# Altium schematic sheet processor.SchDoc: JSK Ultra-tiny Laser Sensor Bottom PCB, JSK Lab, The University of Tokyo
size A4; DrawnBy: XIANGYU CHEN; Revision: V4.5; ProjectName: Jsk_laser Bottom PCB
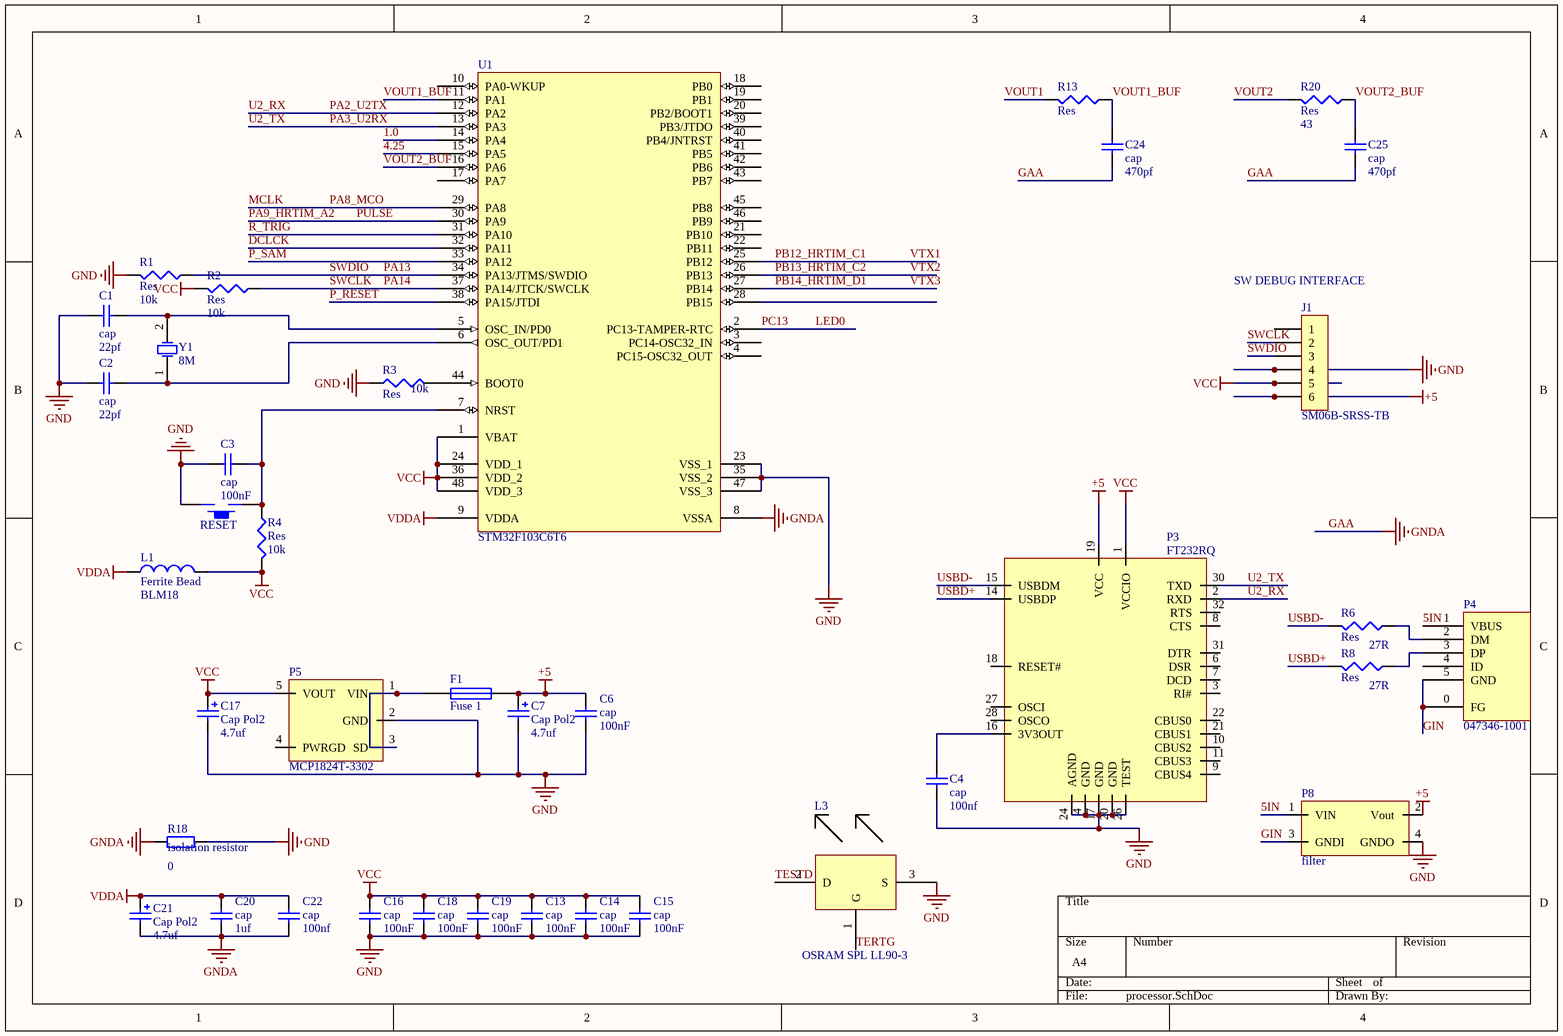
[diagram p0: processor.SchDoc]

## Parts
C1  cap  value 22pf  [J1-0603]
C2  cap  value 22pf  [J1-0603]
C3  cap  value 100nF  [J1-0603]
C4  cap  value 100nf  [J1-0603]
C6  cap  value 100nF  [J1-0603]
C7  Cap Pol2  value 4.7uf  [C1206+]
C13  cap  value 100nF  [J1-0603]
C14  cap  value 100nF  [J1-0603]
C15  cap  value 100nF  [J1-0603]
C16  cap  value 100nF  [J1-0603]
C17  Cap Pol2  value 4.7uf  [C1206+]
C18  cap  value 100nF  [J1-0603]
C19  cap  value 100nF  [J1-0603]
C20  cap  value 1uf  [J1-0603]
C21  Cap Pol2  value 4.7uf  [C1206+]
C22  cap  value 100nf  [J1-0603]
C24  cap  value 470pf  [J1-0603]
C25  cap  value 470pf  [J1-0603]
F1  Fuse 1  [J1-0603]
J1  SM06B-SRSS-TB  [SM06B-SRSS-TB]
L1  Ferrite Bead  value BLM18  [J1-0603]
L3  OSRAM SPL LL90-3  [SPLLL]
P3  FT232RQ  [QFN32]
P4  047346-1001  [047346-1001]
P5  MCP1824T-3302  [SOT-23]
P8  filter  [bx025]
R1  Res  value 10k  [J1-0603]
R2  Res  value 10k  [J1-0603]
R3  Res  value 10k  [J1-0603]
R4  Res  value 10k  [J1-0603]
R6  Res  value 27R  [J1-0603]
R8  Res  value 27R  [J1-0603]
R13  Res  [J1-0603]
R18  isolation resistor  value 0  [J1-0603]
R20  Res  value 43  [J1-0603]
RESET  KEY_M  [TSWITCH]  (value not drawn)
U1  STM32F103C6T6  [LQFP48_L]
Y1  8M  [XTALSMD8]

## Nets
+5: C6.2 C7.1 F1.2 J1.6 P3.19(VCC) P8.2(Vout)
GAA: C20.1 C21.2 C22.1 C24.1 C25.1 R18.1 U1.8(VSSA)  [also labelled GNDA]
GND: C1.1 C2.1 C3.1 C4.1 C6.1 C7.2 C13.1 C14.1 C15.1 C16.1 C17.2 C18.1 C19.1 J1.4 L3.3(S) P3.4(GND) P3.17(GND) P3.20(GND) P3.24(AGND) P3.26(TEST) P5.2(GND) P8.4(GNDO) R1.2 R3.1 R18.2 RESET.2 U1.23(VSS_1) U1.35(VSS_2) U1.47(VSS_3)
VCC: C13.2 C14.2 C15.2 C16.2 C17.1 C18.2 C19.2 J1.5 L1.2 P3.1(VCCIO) P5.5(VOUT) R2.2 R4.2 U1.1(VBAT) U1.24(VDD_1) U1.36(VDD_2) U1.48(VDD_3)
VDDA: C20.2 C21.1 C22.2 L1.1 U1.9(VDDA)
1.0: U1.14(PA4)
4.25: U1.15(PA5)
5IN: P4.1(VBUS) P8.1(VIN)
DCLCK: U1.32(PA11)
GIN: P4.0(FG) P4.5(GND) P8.3(GNDI)
LED0: U1.2(PC13-TAMPER-RTC)  [also labelled PC13]
MCLK: U1.29(PA8)  [also labelled PA8_MCO]
P_RESET: U1.38(PA15/JTDI)
P_SAM: U1.33(PA12)
PA2_U2TX: P3.2(RXD) U1.12(PA2)  [also labelled U2_RX]
PA3_U2RX: P3.30(TXD) U1.13(PA3)  [also labelled U2_TX]
PA9_HRTIM_A2: U1.30(PA9)  [also labelled PULSE]
PA13: J1.3 R1.1 U1.34(PA13/JTMS/SWDIO)  [also labelled SWDIO]
PA14: J1.2 R2.1 U1.37(PA14/JTCK/SWCLK)  [also labelled SWCLK]
PB12_HRTIM_C1: U1.25(PB12)  [also labelled VTX1]
PB13_HRTIM_C2: U1.26(PB13)  [also labelled VTX2]
PB14_HRTIM_D1: U1.27(PB14)  [also labelled VTX3]
R_TRIG: U1.31(PA10)
TERTG: L3.1(G)
TESTD: L3.2(D)
USBD+: P3.14(USBDP) R8.2
USBD-: P3.15(USBDM) R6.2
VOUT1: R13.2
VOUT1_BUF: C24.2 R13.1 U1.11(PA1)
VOUT2: R20.2
VOUT2_BUF: C25.2 R20.1 U1.16(PA6)
NetC1_2: C1.2 U1.5(OSC_IN/PD0) Y1.2(OSC2)
NetC2_2: C2.2 U1.6(OSC_OUT/PD1) Y1.1(OSC1)
NetC3_2: C3.2 R4.1 RESET.1 U1.7(NRST)
NetC4_2: C4.2 P3.16(3V3OUT)
NetF1_1: F1.1 P5.1(VIN) P5.3(SD)
NetP4_2: P4.2(DM) R6.1
NetP4_3: P4.3(DP) R8.1
NetR3_2: R3.2 U1.44(BOOT0)

Not connected (* = marked no-connect by the designer): J1 1; P3 3(RI#) 6(DSR) 7(DCD) 8(CTS) 9(CBUS4) 10(CBUS2) 11(CBUS3) 18(RESET#) 21(CBUS1) 22(CBUS0) 27(OSCI) 28(OSCO) 31(DTR) 32(RTS); P4 4(ID); P5 4(PWRGD); U1 3(PC14-OSC32_IN) 4(PC15-OSC32_OUT) 10(PA0-WKUP) 17(PA7) 18(PB0) 19(PB1) 20(PB2/BOOT1) 21(PB10) 22(PB11) 28(PB15) 39(PB3/JTDO) 40(PB4/JNTRST) 41(PB5) 42(PB6) 43(PB7) 45(PB8) 46(PB9)

## Notes on the sheet
- (near J1) SW DEBUG INTERFACE

## Library data of the parts
C1-C4 C6 C13-C16 C18-C20 C22 C24 C25 = Cap Semi: Capacitor (Semiconductor SIM Model); Published: 8-Jun-2000; LatestRevisionDate: 29-May-2009; LatestRevisionNote: IPC-7351 Footprint Added.; PackageReference: C1206; Publisher: Altium Limited; PackageDescription: Chip Capacitor
C7 C17 C21 = Cap Pol2: Polarized Capacitor (Axial); Published: 8-Jun-2000; LatestRevisionDate: 17-Jul-2002; LatestRevisionNote: Re-released for DXP Platform.; PackageReference: POLAR0.8; Publisher: Altium Limited; PackageDescription: Polarized Capacitor; 2 Leads
F1 = Fuse 1: Fuse; Published: 8-Jun-2000; LatestRevisionDate: 17-Jul-2002; LatestRevisionNote: Re-released for DXP Platform.; PackageReference: PIN-W2/E2.8; Publisher: Altium Limited; PackageDescription: Thru-Hole; 2 Leads
J1 = SM06B-SRSS-TB: Connector; Manufacturer: JST; Assembly: P; PN: SM06B-SRSS-TB; Supplier: JST
L1 = Inductor: Code_IEC: 1005; Published: 8-Jun-2000; LatestRevisionDate: 29-May-2009; LatestRevisionNote: IPC-7351 Footprint Added.; PackageReference: 0402-A; Publisher: Altium Limited; PackageDescription: Chip Inductor; Code_JEITA: 0402
L3 = SPL_laser
P4 = 047346-1001: Micro USB B Connector; Manufacturer: Molex; Assembly: P; PN: 047346-1001
P5 = VOLTREG
R1-R4 R6 R8 R13 R20 = Res3: Resistor; Published: 8-Jun-2000; LatestRevisionDate: 29-May-2009; LatestRevisionNote: IPC-7351 Footprint Added.; PackageReference: J1-0603; Publisher: Altium Limited; PackageDescription: Chip Resistor
R18 = Res2: Resistor; Published: 8-Jun-2000; LatestRevisionDate: 17-Jul-2002; LatestRevisionNote: Re-released for DXP Platform.; PackageReference: AXIAL-0.4; Publisher: Altium Limited; PackageDescription: Axial Device, Thru-Hole; 2 Leads; 0.4 in Pin Spacing
U1 = STM32F103C6T6: STM32 ARM-based 32-bit MCU with 32 Kbytes Flash, 48-pin LQFP, Industrial Temperature; Published: *; DatasheetVersion: *; PackageVersion: *; PackageReference: *; Publisher: *; PackageDescription: *; ComponentLink1Description: *; ComponentLink1URL: *; ComponentLink2Description: *; ComponentLink2URL: *
Y1 = XTAL: Crystal Oscillator; Published: 8-Jun-2000; LatestRevisionDate: 17-Jul-2002; LatestRevisionNote: Re-released for DXP Platform.; PackageReference: R38; Publisher: Altium Limited; PackageDescription: Crystal, Thru-Hole; 2 Leads; Body 3.1 x 8.2 mm (Dia.xH)